# EAGLE design Light's Thrill (EAGLE 9.6.2)
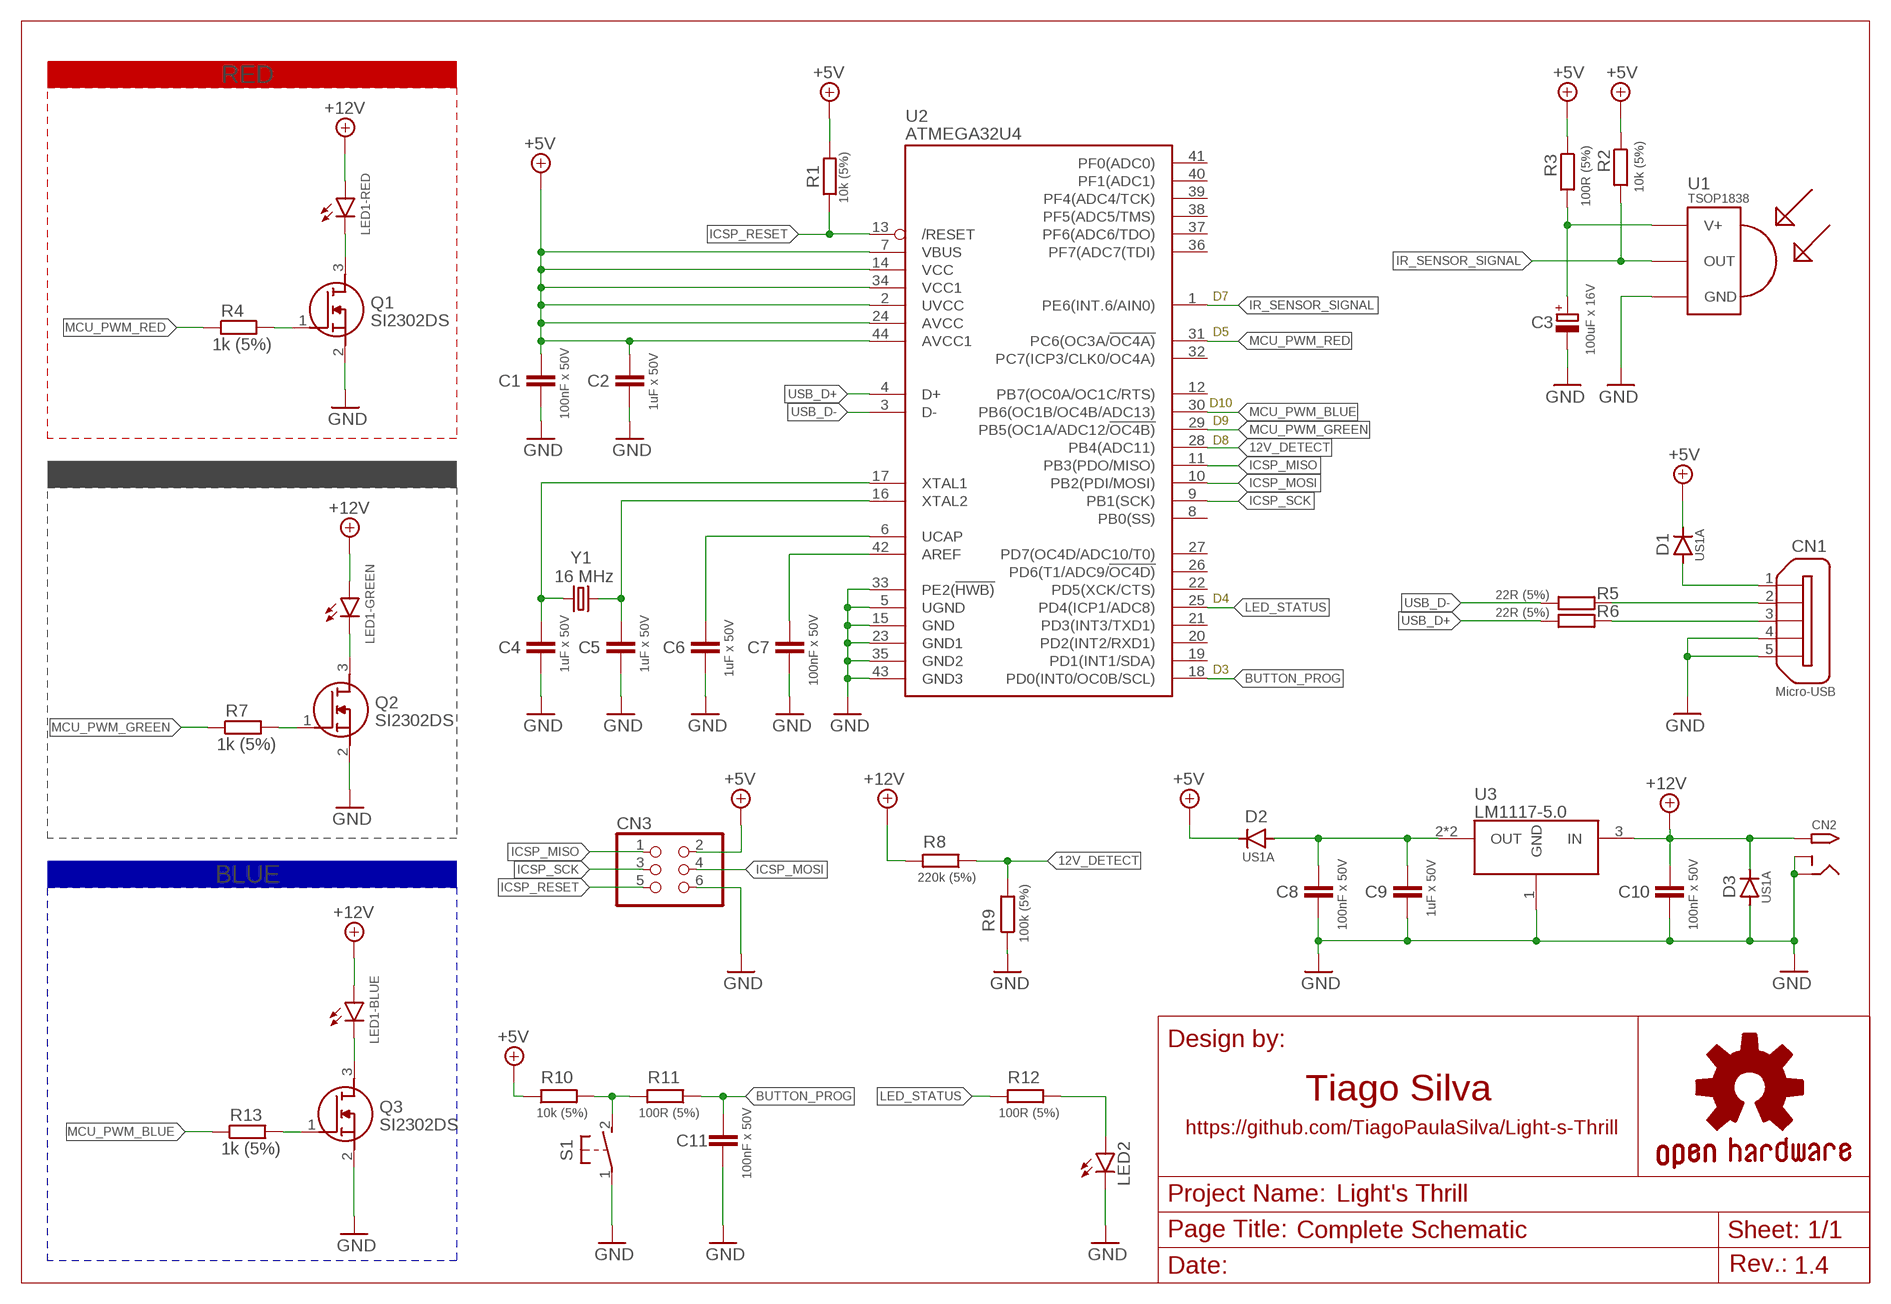
[diagram p0: schematic, sheet 1]

## Parts
C1  100nF x 50V  C-EUC0805  [C0805]
C2  1uF x 50V  C-EUC0805  [C0805]
C3  100uF x 16V  CPOL-EUE2-5  [E2-5]
C4  1uF x 50V  C-EUC0805  [C0805]
C5  1uF x 50V  C-EUC0805  [C0805]
C6  1uF x 50V  C-EUC0805  [C0805]
C7  100nF x 50V  C-EUC0805  [C0805]
C8  100nF x 50V  C-EUC0805  [C0805]
C9  1uF x 50V  C-EUC0805  [C0805]
C10  100nF x 50V  C-EUC0805  [C0805]
C11  100nF x 50V  C-EUC0805  [C0805]
CN1  Micro-USB  ZX62D-B-5PA8  [ZX62D-B-5PA8]
CN2  2.1MMJACKTHM  [PJ-102A]
CN3  2x3  PINHD-2X3  [2X03]
D1  US1A  CGRM4007-G  [SOD-123_MINI-SMA]
D2  US1A  CGRM4007-G  [SOD-123_MINI-SMA]
D3  US1A  CGRM4007-G  [SOD-123_MINI-SMA]
LED1  RGB_LED_STRIP  [STRIP-CONNECTOR]
LED2  Red  LEDCHIPLED_0805  [CHIPLED_0805]
Q1  SI2302DS  [SOT95P230X110-3N]
Q2  SI2302DS  [SOT95P230X110-3N]
Q3  SI2302DS  [SOT95P230X110-3N]
R1  10k (5%)  R-EU_R0805  [R0805]
R2  10k (5%)  R-EU_R0805  [R0805]
R3  100R (5%)  R-EU_R0805  [R0805]
R4  1k (5%)  R-EU_R0805  [R0805]
R5  22R (5%)  R-EU_R0805  [R0805]
R6  22R (5%)  R-EU_R0805  [R0805]
R7  1k (5%)  R-EU_R0805  [R0805]
R8  220k (5%)  R-EU_R0805  [R0805]
R9  100k (5%)  R-EU_R0805  [R0805]
R10  10k (5%)  R-EU_R0805  [R0805]
R11  100R (5%)  R-EU_R0805  [R0805]
R12  100R (5%)  R-EU_R0805  [R0805]
R13  1k (5%)  R-EU_R0805  [R0805]
S1  DTSM-3  [DTSM-3]
U1  TSOP1838  [TSOP18XX]
U2  ATMEGA32U4  ATMEGA32U4-AU  [TQFP44]
U3  LM1117-5.0  LM1117IMP-5.0-NOPB  [SOT223]
Y1  16 MHz  KX-9A  [5.0X3.2_KX-9A]

## Nets
12V_DETECT: R8.1 R9.2 U2.28(PB4(ADC11))
+5V: C1.1 C2.1 CN3.2 D1.C D2.C R1.2 R2.1 R3.1 R10.1 U2.2(UVCC) U2.7(VBUS) U2.14(VCC) U2.24(AVCC) U2.34(VCC1) U2.44(AVCC1)
+12V: C10.1 CN2.TIP D3.C LED1.1 R8.2 U3.3(IN)
BUTTON_PROG: C11.1 R11.1 U2.18(PD0(INT0/OC0B/SCL))
GND: C1.2 C2.2 C3.- C4.2 C5.2 C6.2 C7.2 C8.2 C9.2 C10.2 C11.2 CN1.4 CN1.5 CN2.RING CN2.RING_SW CN3.6 D3.A LED2.C Q1.2(S) Q2.2(S) Q3.2(S) R9.1 S1.1 U1.GND U2.5(UGND) U2.15(GND) U2.23(GND1) U2.33(PE2(!HWB)) U2.35(GND2) U2.43(GND3) U3.1(GND)
ICSP_MISO: CN3.1 U2.11(PB3(PDO/MISO))
ICSP_MOSI: CN3.4 U2.10(PB2(PDI/MOSI))
ICSP_RESET: CN3.5 R1.1 U2.13(/RESET)
ICSP_SCK: CN3.3 U2.9(PB1(SCK))
IR_SENSOR_SIGNAL: R2.2 U1.OUT U2.1(PE6(INT.6/AIN0))
LED_STATUS: R12.1 U2.25(PD4(ICP1/ADC8))
MCU_PWM_BLUE: R13.1 U2.30(PB6(OC1B/OC4B/ADC13))
MCU_PWM_GREEN: R7.1 U2.29(PB5(OC1A/ADC12/!OC4B))
MCU_PWM_RED: R4.1 U2.31(PC6(OC3A/!OC4A))
N$1: Q1.1(G) R4.2
N$2: LED1.3 Q1.3(D)
N$3: Q2.1(G) R7.2
N$4: Q3.1(G) R13.2
N$5: LED1.2 Q2.3(D)
N$6: LED1.4 Q3.3(D)
N$7: C3.+ R3.2 U1.VCC(V+)
N$8: CN1.2 R5.2
N$9: CN1.3 R6.2
N$11: C6.1 U2.6(UCAP)
N$12: C7.1 U2.42(AREF)
N$13: C4.1 U2.17(XTAL1) Y1.1
N$14: C5.1 U2.16(XTAL2) Y1.3
N$15: CN1.1 D1.A
N$16: C8.1 C9.1 D2.A U3.2(OUT) U3.4(OUT)
N$17: R10.2 R11.2 S1.2
N$18: LED2.A R12.2
USB_D+: R6.1 U2.4(D+)
USB_D-: R5.1 U2.3(D-)
Unconnected: CN1.S1 CN1.S2 CN1.S3 CN1.S4 U2.8(PB0(SS)) U2.12(PB7(OC0A/OC1C/RTS)) U2.19(PD1(INT1/SDA)) U2.20(PD2(INT2/RXD1)) U2.21(PD3(INT3/TXD1)) U2.22(PD5(XCK/CTS)) U2.26(PD6(T1/ADC9/!OC4D)) U2.27(PD7(OC4D/ADC10/T0)) U2.32(PC7(ICP3/CLK0/OC4A)) U2.36(PF7(ADC7(TDI)) U2.37(PF6(ADC6/TDO)) U2.38(PF5(ADC5/TMS)) U2.39(PF4(ADC4/TCK)) U2.40(PF1(ADC1)) U2.41(PF0(ADC0))

## Notes on the sheet
- RED
- D7
- D5
- D10
- D9
- D8
- GREEN
- D4
- D3
- BLUE
- Tiago Silva
- https://github.com/TiagoPaulaSilva/Light-s-Thrill
- Complete Schematic
- 1.4

## Library data of the parts
C1 C2 C4-C11 = rcl:C-EU: CAPACITOR, European symbol; SPICEPREFIX: C
C3 = rcl:CPOL-EU: POLARIZED CAPACITOR, European symbol; SPICEPREFIX: C
CN1 = Micro USB Connector:ZX62D-B-5PA8: Micro USB Type B Connector - Standard, Shell Through Hole Source: http://www.hirose.co.jp/cataloge_hp/ed_ZX_20140804.pdf; MF: Hirose; MPN: ZX62D-B-5PA8; OC_FARNELL: 2300438; OC_NEWARK: 69W0712
CN2 = adafruit:2.1MMJACK: 2.1mm x 5.5mm THM DC jack with internal switch. Digikey part #PJ-102A, 4UCON part #05537 2.1mm x 5.5mm SMT DC jack with internal switch. Digikey part #PJ-002A-SMT, 4UCON part #03267 By microbuilder.eu & adafruit.com
CN3 = pinhead:PINHD-2X3: PIN HEADER
D1-D3 = diode:CGRM400*-G: Molded plasitc,JEDEC SOD-123/Mini SMA Source: Comchip CGRM4001-G.pdf
LED1 = led:RGB_LED_STRIP
LED2 = led:LED: LED OSRAM: - CHIPLED LG R971, LG N971, LY N971, LG Q971, LY Q971, LO R971, LY R971 LH N974, LH R974 LS Q976, LO Q976, LY Q976 LO Q996 - Hyper CHIPLED LW Q18S LB Q993, LB Q99A, LB R99A - SideLED LS A670, LO A670, LY A670, LG A670, LP A670 LB A673, LV A673, LT A673, LW A673 LH A674 LY A675 LS A676, LA A676, LO A676, LY A676, LW A676 LS A679, LY A679, LG A679 - Hyper Micro SIDELED® LS Y876, LA Y876, LO Y876, LY Y876 LT Y87S - SmartLED LW L88C, LW L88S LB L89C, LB L89S, LG L890 LS L89K, LO L89K, LY L89K LS L896, LA L896, LO L896, LY L896 - TOPLED LS T670, LO T670, LY T670, LG T670, LP T670 LSG T670, LSP T670, LSY T670, LOP T670, LYG T670 LG T671, LOG T671, LSG T671 LB T673, LV T673, LT T673, LW T673 LH T674 LS T676, LA T676, LO T676, LY T676, LB T676, LH T676, LSB T676, LW T676 LB T67C, LV T67C, LT T67C, LS T67K, LO T67K, LY T67K, LW E67C LS E67B, LA E67B, LO E67B, LY E67B, LB E67C, LV E67C, LT E67C LW T67C LS T679, LY T679, LG T679 LS T770, LO T770, LY T770, LG T770, LP T770 LB T773, LV T773, LT T773, LW T773 LH T774 LS E675, LA E675, LY E675, LS T675 LS T776, LA T776, LO T776, LY T776, LB T776 LHGB T686 LT T68C, LB T68C - Hyper Mini TOPLED® LB M676 - Mini TOPLED Santana® LG M470 LS M47K, LO M47K, LY M47K Source: http://www.osram.convergy.de LUXEON: - LUMILED® LXK2-PW12-R00, LXK2-PW12-S00, LXK2-PW14-U00, LXK2-PW14-V00 LXK2-PM12-R00, LXK2-PM12-S00, LXK2-PM14-U00 LXK2-PE12-Q00, LXK2-PE12-R00, LXK2-PE12-S00, LXK2-PE14-T00, LXK2-PE14-U00 LXK2-PB12-K00, LXK2-PB12-L00, LXK2-PB12-M00, LXK2-PB14-N00, LXK2-PB14-P00, LXK2-PB14-Q00 LXK2-PR12-L00, LXK2-PR12-M00, LXK2-PR14-Q00, LXK2-PR14-R00 LXK2-PD12-Q00, LXK2-PD12-R00, LXK2-PD12-S00 LXK2-PH12-R00, LXK2-PH12-S00 LXK2-PL12-P00, LXK2-PL12-Q00, LXK2-PL12-R00 Source: www.luxeon.com KINGBRIGHT: KA-3528ASYC Source: www.kingbright.com
Q1-Q3 = SI2302DS:SI2302DS: NXP SI2302DS N-channel MOSFET Transistor, 2.5 A, 20 V, 3-Pin TO-236AB Source: Datasheet <https://assets.nexperia.com/documents/data-sheet/SI2302DS.pdf>; ARROW_PART_NUMBER: SI2302DS; DESCRIPTION: NXP SI2302DS N-channel MOSFET Transistor, 2.5 A, 20 V, 3-Pin TO-236AB; HEIGHT: 1.1mm; MANUFACTURER_NAME: Nexperia; MANUFACTURER_PART_NUMBER: SI2302DS; MOUSER_PART_NUMBER: N/A; MOUSER_PRICE-STOCK: https://www.mouser.com/Search/Refine.aspx?Keyword=N%2FA
R1-R13 = rcl:R-EU_: RESISTOR, European symbol; SPICEPREFIX: R
S1 = switch-tact2:DTSM-3
U1 = TSOP1838:TSOP1838: IR Receiver and Demodulator; AVAILABILITY: Unavailable; DESCRIPTION: IR Remote Receiver 38KHz 35m 3-Pin; MF: Vishay; MP: TSOP1838; PACKAGE: None; PRICE: None
U2 = adafruit:ATMEGA32U4: http://www.ladyada.net/library/eagle
U3 = LM1117IMP-5.0-NOPB:LM1117IMP-5.0-NOPB: http://octopart.com/lm1117imp-5.0-nopb-texas+instruments-6999170; AVAILABILITY: Unavailable; MF: Texas Instruments; MP: LM1117IMP50; PACKAGE: SOT-223 Texas Instruments; PRICE: None
Y1 = crystal-geyer_V1_0:KX: Quartz Crystals (MHz) SMD: KX - Serie Model Size l/w/h [mm] Frequency Range Frequency Stability Temp. Range [°C] Load Capacitance AECQ 200 availabel Datasheet KX-4 KX-5 KX-6 KX-7 KX-9A KX-9B KX-12A KX-12B KX-13 KX-20 KX-K KX-KS 1.6/1.2/0.3 2.0/1.6/0.45 2.5/2.0/0.55 3.2/2.5/0.8 5.0/3.2/1.0 5.0/3.2/1.1 6.0/3.5/1.1 6.0/3.5/1.0 7.0/5.0 /1.3 11.6/5.5/1.6 12.3/4.5/4.2 12.3/4.5/3.2 24.0 ~ 80.0 MHz 16.0 ~ 80.0 MHz 12.0 ~ 80.0 MHz 8.0 ~ 60.0 MHz 7,68 ~ 300,0 MHz 8,0 ~ 50,0 MHz 8,0 ~ 150,0 MHz 8,0 ~ 50,0 MHz 6,0 ~ 160,0 MHz 3,579 ~ 25,0 MHz 3,579 ~ 70,0 MHz 3,579 ~ 70,0 MHz ±10 … ±50ppm ±10 … ±50ppm ±10 … ±50ppm ±10 … ±50ppm ±10 … ±50ppm ±10 … ±50ppm ±10 … ±50ppm ±10 … ±50ppm ±10 … ±50ppm ±50ppm ±10 … ±50ppm ±10 … ±50ppm (*) -40°C …+85°C (*) -40°C …+125°C (*) -40°C …+125°C (*) -40°C …+125°C (*) -40°C …+105°C (*) -40°C …+105°C (*) -40°C …+125°C (*) -40°C …+105°C (*) -40°C …+105°C (*) -40°C …+105°C (*) -40°C …+85°C (*) -40°C …+85°C 8, 8…16 8, 8…16 10, 8…16 12, 7…20 16, 10…20 16, 10…20 16, 10…20 16, 12…20 16, 12…20 16, 12…20 16, 12…30 16, 12…30 - yes yes yes - - - - - - - - KX-4.pdf <http://www.geyer-electronic.de/uploads/tx_userartikelfrequenz/GEYER-KX-4.pdf> KX-5.pdf <http://www.geyer-electronic.de/uploads/tx_userartikelfrequenz/GEYER-KX-5.pdf> KX-6.pdf <http://www.geyer-electronic.de/uploads/tx_userartikelfrequenz/GEYER-KX-6.pdf> KX-7.pdf <http://www.geyer-electronic.de/uploads/tx_userartikelfrequenz/GEYER-KX-7.pdf> KX-9A.pdf <http://www.geyer-electronic.de/uploads/tx_userartikelfrequenz/GEYER-KX-9A.pdf> KX-9B.pdf <http://www.geyer-electronic.de/uploads/tx_userartikelfrequenz/GEYER-KX-9B.pdf> KX-12A.pdf <http://www.geyer-electronic.de/uploads/tx_userartikelfrequenz/GEYER-KX-12A.pdf> KX-12B.pdf <http://www.geyer-electronic.de/uploads/tx_userartikelfrequenz/GEYER-KX-12B.pdf> KX-13.pdf <http://www.geyer-electronic.de/uploads/tx_userartikelfrequenz/GEYER-KX-13.pdf> KX-20.pdf <http://www.geyer-electronic.de/uploads/tx_userartikelfrequenz/GEYER-KX-20.pdf> KX-K.pdf <http://www.geyer-electronic.de/uploads/tx_userartikelfrequenz/GEYER-KX-K.pdf> KX-KS.pdf <http://www.geyer-electronic.de/uploads/tx_userartikelfrequenz/GEYER-KX-KS.pdf> <http://www.geyer-electronic.de/fileadmin/template/img/logo-geyer-electronic.png> Details see: http://www.geyer-electronic.de/Frequenz-Produkte.9.0.html Created 2016-06-07, Hans Locher 2016 (C) Geyer Quartz Technology KX4,KX5,KX6,KX7,KX9A,KX9B,KX12A,KX12B,KX13,KX20,KXK,KXKS;1612;2016;2520;3225;5032;6035;7050;11655;12345;1,6x1,2;2,0x1,6;2,5x2,0;3,2x2,5;5,0x3,2;6,0x3,5;7,0x5,0;11,6x5,5;12,3x4,5;12,3x4,5;1.6x1.2;2.0x1.6;2.5x2.0;3.2x2.5;5.0x3.2;6.0x3.5;7.0x5.0;11.6x5.5;12.3x4.5;12.3x4.5;

## Board
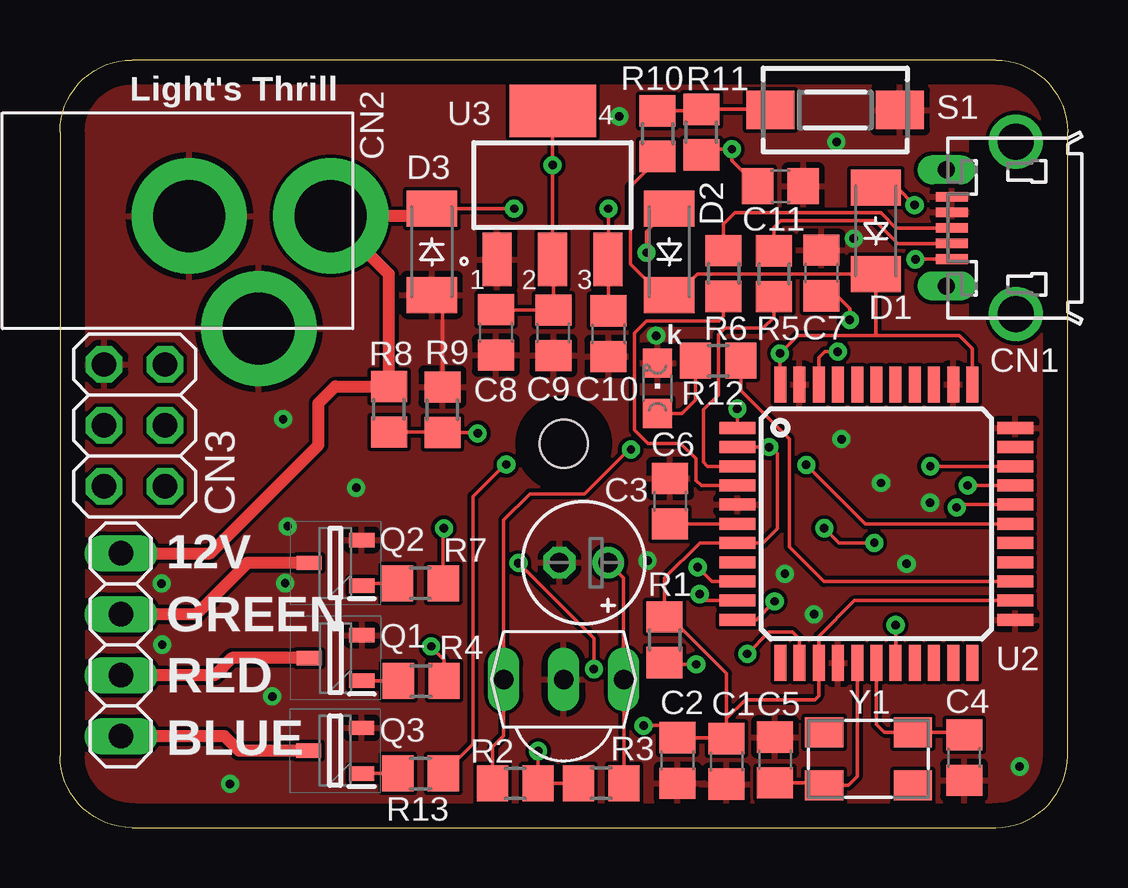
[diagram p1: board, top side]
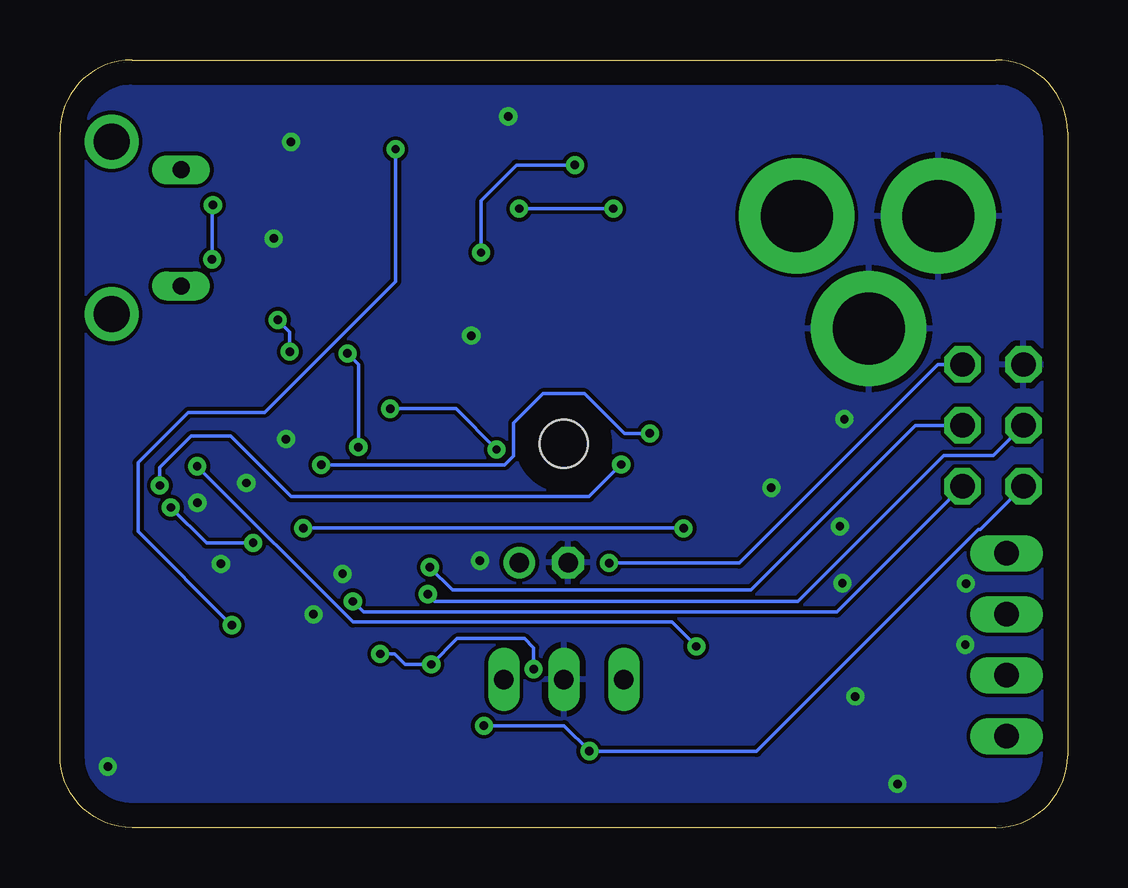
[diagram p2: board, bottom side, seen from below]

Size 42 x 32 mm. Coordinates in mm from the lower left corner, seen from the top.
Outline: 3,0 39,0 arc90 42,3 42,29 arc90 39,32 3,32 arc90 0,29 0,3 arc90 3,0
Copper layers (1*16): Top 0.035mm / dielectric 1.5mm / Bottom 0.035mm
Design rules "default *": minimum track width 6mil, minimum drill 0.35mm, track to track 6mil, track to pad 6mil, pad to pad 6mil, via to via 6mil, smd to smd 6mil, copper to edge 40mil, drill to drill 6mil, minimum pad ring 10mil, minimum via ring 8mil, stop-mask expansion 4mil, vias tented up to drill 14mil, thermal gap 10mil
Holes 2 mm at 21,16

### Footprints (pad centres in the part's own frame; a part is rotated, then mirrored left to right if it is on the bottom)
C0805 = smd 1.3 x 1.5: 1 -0.95,0; 2 0.95,0
E2-5 = drill 0.813 pad 1.27: + -1.016,0 | drill 0.813 pad 1.27 octagon: - 1.016,0
ZX62D-B-5PA8 = smd 1.35 x 0.4: 1 4.825,1.3; 2 4.825,0.65; 3 4.825,0; 4 4.825,-0.65; 5 4.825,-1.3 | drill 1.5: S1 2.15,-3.6; S2 2.15,3.6 | drill 0.7 long: S3 5.05,2.425; S4 5.05,-2.425
PJ-102A = drill 3 pad 4.8: RING 0.1,-3.39; RING_SW -4.6,-6.29; TIP 0.1,-9.29
2X03 = drill 1.016 octagon: 1 -2.54,-1.27; 2 -2.54,1.27; 3 0,-1.27; 4 0,1.27; 5 2.54,-1.27; 6 2.54,1.27
SOD-123_MINI-SMA = smd 1.5 x 2.1: A 1.8,0; C -1.8,0
STRIP-CONNECTOR = drill 1.016 long: 1 -3.81,0; 2 -1.27,0; 3 1.27,0; 4 3.81,0
CHIPLED_0805 = smd 1.2 x 1.2: A 0,-1.05; C 0,1.05
SOT95P230X110-3N = smd 1.05 x 0.6: 1 -1.1,0.95; 2 -1.1,-0.95; 3 1.1,0
R0805 = smd 1.3 x 1.5: 1 -0.95,0; 2 0.95,0
DTSM-3 = smd 2 x 1.6: 1 -2.7,0; 2 2.7,0
TSOP18XX = drill 0.813 long: GND -0.001,-0.027; OUT -2.501,-0.027; VCC 2.499,-0.027
TQFP44 = smd 1.5 x 0.5: 1 -5.8,4; 2 -5.8,3.2; 3 -5.8,2.4; 4 -5.8,1.6; 5 -5.8,0.8; 6 -5.8,0; 7 -5.8,-0.8; 8 -5.8,-1.6; 9 -5.8,-2.4; 10 -5.8,-3.2; 11 -5.8,-4; 23 5.8,-4; 24 5.8,-3.2; 25 5.8,-2.4; 26 5.8,-1.6; 27 5.8,-0.8; 28 5.8,0; 29 5.8,0.8; 30 5.8,1.6; 31 5.8,2.4; 32 5.8,3.2; 33 5.8,4 | smd 0.5 x 1.5: 12 -4,-5.8; 13 -3.2,-5.8; 14 -2.4,-5.8; 15 -1.6,-5.8; 16 -0.8,-5.8; 17 0,-5.8; 18 0.8,-5.8; 19 1.6,-5.8; 20 2.4,-5.8; 21 3.2,-5.8; 22 4,-5.8; 34 4,5.8; 35 3.2,5.8; 36 2.4,5.8; 37 1.6,5.8; 38 0.8,5.8; 39 0,5.8; 40 -0.8,5.8; 41 -1.6,5.8; 42 -2.4,5.8; 43 -3.2,5.8; 44 -4,5.8
SOT223 = smd 2.235 x 1.219: 1 -3.099,2.311; 2 -3.099,0; 3 -3.099,-2.311 | smd 2.2 x 3.6: 4 3.099,0
5.0X3.2_KX-9A = smd 1.6 x 1.25: 1 -1.85,-1.1; 2 1.85,-1.1; 3 1.85,1.1; 4 -1.85,1.1

### Placement (x,y rotation side)
C1  27.79,2.76 270 top
C2  25.74,2.8 270 top
C3  21.84,11.04 180 top
C4  37.69,2.92 270 top
C5  29.81,2.82 90 top
C6  25.44,13.6 90 top
C7  31.74,23.12 90 top
C8  18.17,20.64 270 top
C9  20.56,20.63 270 top
C10  22.86,20.59 270 top
C11  30.03,26.73 0 top
CN1  42,25 180 top
CN2  2,25.4 90 top
CN3  3.11,16.76 90 top
D1  34.01,24.87 90 top
D2  25.4,24 90 top
D3  15.5,24 270 top
LED1  2.54,7.62 270 top
LED2  24.91,18.31 0 top
Q1  11.48,7.07 180 top
Q2  11.48,11.03 180 top
Q3  11.47,3.21 180 top
R1  25.21,7.83 90 top
R2  18.98,1.84 180 top
R3  22.56,1.85 0 top
R4  15.05,6.11 180 top
R5  29.76,23.09 90 top
R6  27.66,23.1 90 top
R7  15.03,10.18 180 top
R8  13.71,17.44 90 top
R9  15.94,17.42 270 top
R10  24.91,28.93 90 top
R11  26.73,28.99 90 top
R12  27.44,19.46 180 top
R13  15.03,2.25 180 top
S1  32.32,29.91 180 top
U1  21,6.2 0 top
U2  34.03,12.66 0 top
U3  20.53,26.78 90 top
Y1  33.7,2.87 180 top

### Tracks (layer width: path | path; a pad name or v marks a point on that pad's centre or on a via)
12V_DETECT  (via drill 0.35)
  Top 0.152: R8.1 15.92,16.49 R9.2 17.37,16.47 v17.41,16.43 | U2.28 33.57,12.66 v31.11,15.12
  Bottom 0.152: v17.41,16.43 18.47,16.43 20.13,18.09 21.87,18.09 23.09,16.87 23.09,15.49 23.46,15.12 v31.11,15.12
+5V  (via drill 0.35)
  Top 0.152: C2.1 27.75,3.75 C1.1 | C1.1 27.79,4.55 28.57,5.33 31.46,5.33 31.63,5.5 U2.14 31.63,7.97 33.12,9.46 U2.24 | C1.1 27.79,6.42 25.43,8.78 R1.2 25.21,10.4 26.67,11.86 U2.7 29.31,11.86 29.91,12.46 29.91,15.59 29.64,15.86 v29.56,15.86 U2.2 | U2.34 38.03,19.96 37.48,20.51 34.09,20.51 | 34.09,20.51 30.76,20.51 v30.02,19.76 30.02,18.48 U2.44 | 34.09,20.51 34.01,20.59 D1.C 26.57,23.07 25.7,22.2 D2.C 25.08,22.2 23.78,23.5 23.78,26.71 24.91,27.85 R10.1 | C2.1 | C2.1 25.23,4.26 v24.34,4.26 v24.33,4.25 | v19.93,3.19 R2.1 R3.1
  Bottom 0.152: v30.02,19.76 29.56,19.31 v29.56,15.86 | CN3.2 3.64,12.42 3.71,12.42 12.97,3.17 19.93,3.17 v19.93,3.19 20.99,4.25 v24.33,4.25
+12V  (via drill 0.35)
  Top 0.152: C10.1 22.86,23.66 22.86,23.67 | 22.86,23.67 U3.3 | D3.C v18.93,25.8 | v22.86,25.8 22.86,23.67
  Top 0.508: LED1.1 6.26,11.43 10.78,15.95 10.78,17.69 11.48,18.39 R8.2 13.71,23.08 CN2.TIP 15.19,25.5 D3.C
  Bottom 0.152: v18.93,25.8 v22.86,25.8
BUTTON_PROG  (via drill 0.35)
  Top 0.152: v34.84,8.44 U2.18 | C11.1 28.01,27.8 v28.01,28.28 26.97,28.28 R11.1
  Bottom 0.152: v34.84,8.44 v34.84,8.43 38.75,12.34 38.75,15.21 36.66,17.3 33.48,17.3 28.01,22.77 v28.01,28.28
GND  (via drill 0.35)
  Top 0.152: D3.A 15.94,21.76 R9.1
  other vias: 30.22,10.58 31.43,8.89 35.29,11 40.01,2.54 32.58,16.19 24.85,20.51 32.37,28.59 23.31,29.65 33.09,24.56 24.5,11.13 34.23,14.36 36.27,13.54 9.49,12.56 9.39,10.19 9.3,17.03 12.35,14.17 7.09,1.82 8.85,5.47 4.26,7.63 4.24,10.17
  pour Top: 3.81,0 38.73,0 arc90 41.91,3.17 41.91,29.21 arc90 39.05,32.07 3.17,32.07 arc90 0,28.89 0,3.17 arc90 3.17,0
  pour Bottom: 3.17,0 38.73,0 arc90 41.91,3.17 41.91,29.21 arc90 39.05,32.07 3.17,32.07 arc90 0,28.89 0,3.17 arc90
ICSP_MISO  (via drill 0.35)
  Top 0.152: U2.11 29.02,8.66 v29.79,9.43
  Bottom 0.152: CN3.1 9.62,8.98 29.34,8.98 v29.79,9.43
ICSP_MOSI  (via drill 0.35)
  Top 0.152: v26.67,9.73 26.94,9.46 U2.10
  Bottom 0.152: CN3.4 3.09,15.52 5.15,15.52 11.24,9.43 26.38,9.43 v26.67,9.72 | v26.67,9.72 | v26.67,9.72 v26.67,9.73
ICSP_RESET  (via drill 0.35)
  Top 0.152: R1.1 25.28,6.8 v26.52,6.8 | U2.13 30.83,7.86 30.54,8.15 29.55,8.15 v28.65,7.25 v28.65,7.24 | v19.11,11.03 22.25,7.88 v22.25,6.61
  Bottom 0.152: v28.65,7.24 28.06,7.24 27.62,6.8 v26.52,6.8 v26.52,6.81 25.44,7.88 22.64,7.88 22.25,7.5 v22.25,6.61 | CN3.5 5.41,19.3 13.68,11.03 v19.11,11.03
ICSP_SCK  (via drill 0.35)
  Top 0.152: v26.58,10.85 27.18,10.26 U2.9
  Bottom 0.152: CN3.3 6.34,16.76 13.19,9.91 25.64,9.91 v26.58,10.85
IR_SENSOR_SIGNAL  (via drill 0.35)
  Top 0.152: U2.1 v28.23,17.45 v28.23,17.46 | v23.8,15.76 23.72,15.76 21.87,13.91 19.59,13.91 18.5,12.82 U1.OUT 18.5,3.82 18.03,3.36 R2.2
  Bottom 0.152: v28.23,17.46 25.49,17.46 v23.8,15.77 v23.8,15.76
LED_STATUS
  Top 0.152: U2.25 31.84,10.26 30.4,11.7 30.4,16.2 28.39,18.21 R12.1
MCU_PWM_BLUE  (via drill 0.35)
  Top 0.152: v37.84,14.26 U2.30 | R13.1 17.21,3.49 17.21,13.8 18.55,15.13 v18.61,15.13
  Bottom 0.152: v37.84,14.26 37.84,15.02 36.54,16.32 34.89,16.32 32.37,13.8 19.94,13.8 v18.61,15.13
MCU_PWM_GREEN  (via drill 0.35)
  Top 0.152: v31.86,12.48 32.47,11.87 v33.95,11.87 | U2.29 37.5,13.46 v37.38,13.34 | R7.1 15.98,12.45 v16,12.47
  Bottom 0.152: v37.38,13.34 35.89,11.85 33.95,11.85 v33.95,11.87 | v31.86,12.48 v16.01,12.48 v16,12.47
MCU_PWM_RED  (via drill 0.35)
  Top 0.152: U2.31 v36.28,15.06 | R4.1 16,7 15.47,7.53 v15.47,7.55
  Bottom 0.152: v36.28,15.06 29.79,8.57 16.49,8.57 v15.47,7.55
N$1
  Top 0.152: Q1.1 R4.2
N$2
  Top 0.508: Q1.3 7.16,7.07 6.44,6.35 LED1.3
N$3
  Top 0.152: Q2.1 12.68,10.18 R7.2
N$4
  Top 0.152: Q3.1 R13.2
N$5
  Top 0.508: Q2.3 7.82,11.03 5.68,8.89 LED1.2
N$6
  Top 0.508: Q3.3 7.47,3.21 6.86,3.81 LED1.4
N$7
  Top 0.152: C3.+ 23.5,10.4 U1.VCC 23.51,6.16 R3.2
N$8
  Top 0.152: CN1.2 34.92,24.35 33.97,25.31 30.05,25.31 29.76,25.02 R5.2
N$9
  Top 0.152: R6.2 27.66,25.16 28.14,25.64 34.21,25.64 34.85,25 CN1.3
N$11
  Top 0.152: U2.6 C6.1
N$12  (via drill 0.35)
  Top 0.152: U2.42 31.63,19.59 31.88,19.84 v32.42,19.84 | v32.92,21.16 32.92,21.63 32.38,22.17 C7.1
  Bottom 0.152: v32.42,19.84 32.42,20.66 v32.92,21.16
N$13
  Top 0.152: U2.17 34.03,4.31 34.37,3.97 Y1.1 37.59,3.97 C4.1
N$14
  Top 0.152: C5.1 31.75,1.87 Y1.3 32.87,1.77 33.23,2.13 U2.16
N$15  (via drill 0.35)
  Top 0.152: CN1.1 v35.67,23.7 v35.66,23.69 | v35.62,25.95 34.91,26.67 D1.A
  Bottom 0.152: v35.66,23.69 35.66,25.91 v35.62,25.95
N$16  (via drill 0.35)
  Top 0.152: U3.4 v20.53,27.62 U3.2 20.56,23.65 C9.1 18.19,21.58 C8.1 | D2.A 24.45,24.85 v24.45,23.97
  Bottom 0.152: v24.45,23.97 24.45,26.14 22.97,27.62 v20.53,27.62
N$17
  Top 0.152: R10.2 26.67,29.88 R11.2 29.59,29.94 S1.2
N$18
  Top 0.152: LED2.A 25.93,17.26 26.49,17.82 R12.2
USB_D+
  Top 0.152: U2.4 26.73,14.26 26.51,14.48 26.51,15.38 25.87,16.02 24.5,16.02 23.94,16.58 23.94,20.61 24.45,21.12 27.46,21.12 27.66,21.32 R6.1
USB_D-
  Top 0.152: U2.3 27,15.06 26.82,15.24 26.82,17.42 27.44,18.04 27.44,20.55 27.71,20.82 29.31,20.82 29.76,21.27 R5.1

### Text on the board
tPlace: Light's Thrill | k | 12V | GREEN | RED | BLUE